# Altium schematic sheet Radio1.SchDoc
size A4
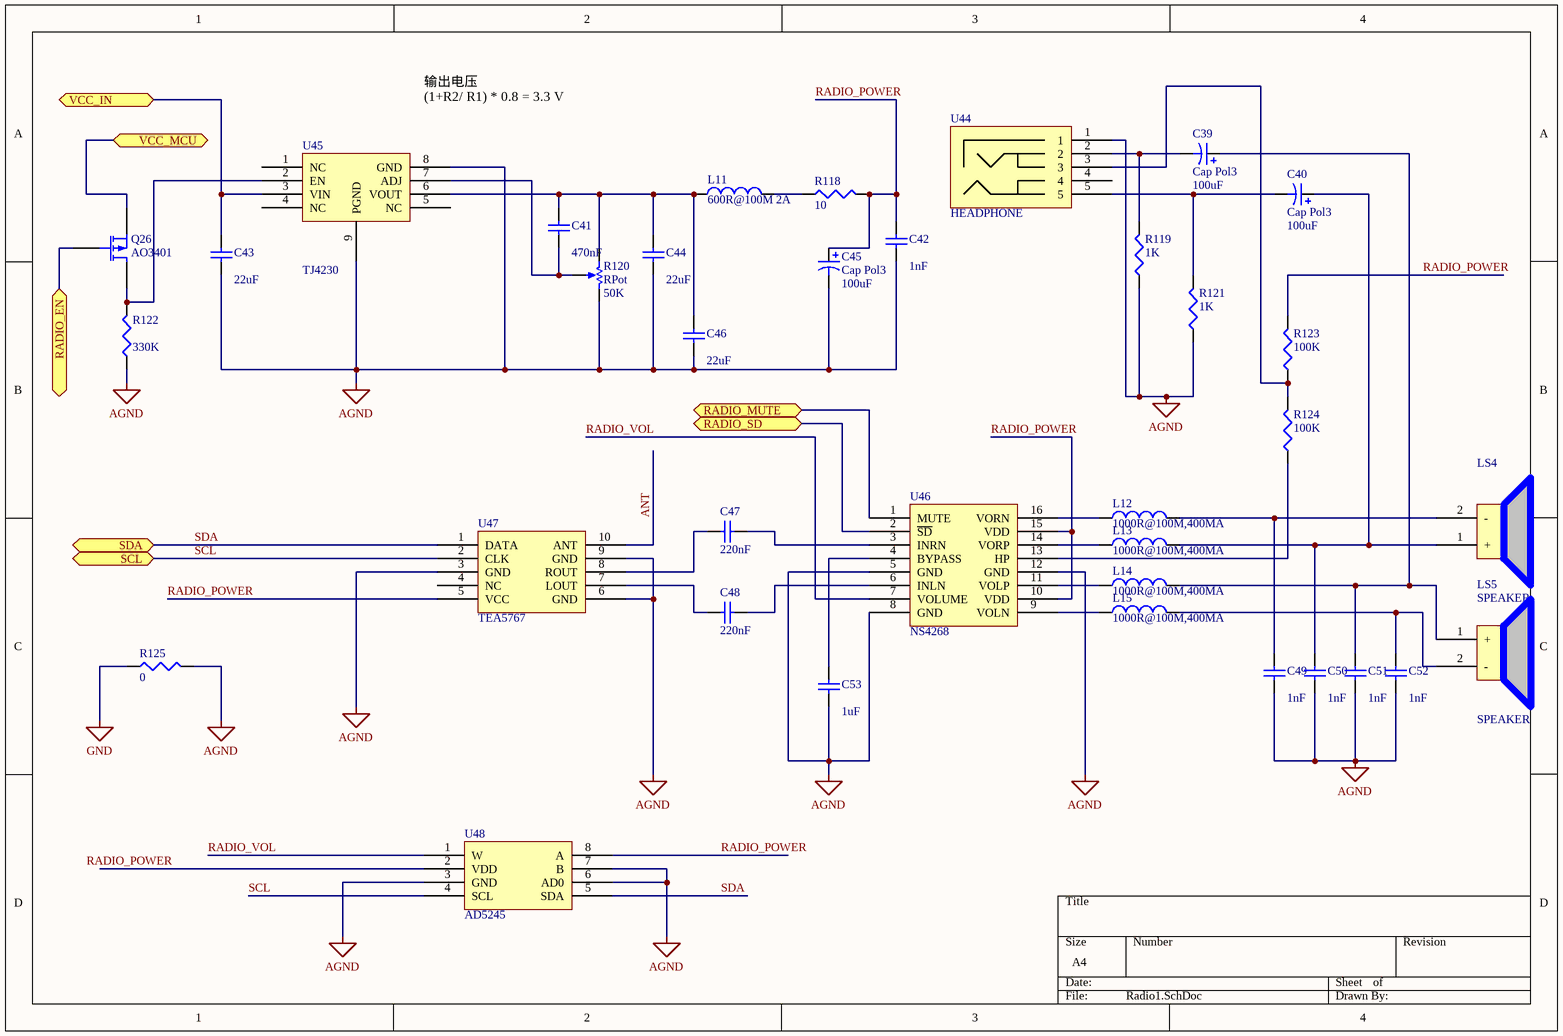
[diagram p0: Radio1.SchDoc]

## Parts
C39  Cap Pol3  value 100uF  [TC7343-2917]
C40  Cap Pol3  value 100uF  [TC7343-2917]
C41  value 470nF  [0603]  (hidden comment: Cap Semi)
C42  value 1nF  [0603]  (hidden comment: Cap Semi)
C43  value 22uF  [1206]  (hidden comment: Cap Semi)
C44  value 22uF  [1206]  (hidden comment: Cap Semi)
C45  Cap Pol3  value 100uF  [TC7343-2917]
C46  value 22uF  [1210]  (hidden comment: Cap Semi)
C47  value 220nF  [0603]  (hidden comment: Cap Semi)
C48  value 220nF  [0603]  (hidden comment: Cap Semi)
C49  value 1nF  [0603]  (hidden comment: Cap Semi)
C50  value 1nF  [0603]  (hidden comment: Cap Semi)
C51  value 1nF  [0603]  (hidden comment: Cap Semi)
C52  value 1nF  [0603]  (hidden comment: Cap Semi)
C53  value 1uF  [0603]  (hidden comment: Cap Semi)
L11  value 600R@100M 2A  [AXIAL-0.6]  (hidden comment: Inductor)
L12  value 1000R@100M,400MA  [0805]  (hidden comment: Inductor)
L13  value 1000R@100M,400MA  [0805]  (hidden comment: Inductor)
L14  value 1000R@100M,400MA  [0805]  (hidden comment: Inductor)
L15  value 1000R@100M,400MA  [0805]  (hidden comment: Inductor)
LS4  SPEAKER  [SPEAKER]
LS5  SPEAKER  [SPEAKER]
Q26  AO3401  [SOT23-3-PMOS]
R118  value 10  [0603]  (hidden comment: Res3)
R119  value 1K  [0603]  (hidden comment: Res3)
R120  RPot  value 50K  [VR5]
R121  value 1K  [0603]  (hidden comment: Res3)
R122  value 330K  [0603]  (hidden comment: Res3)
R123  value 100K  [0603]  (hidden comment: Res3)
R124  value 100K  [0603]  (hidden comment: Res3)
R125  value 0  [0603]  (hidden comment: Res3)
U44  HEADPHONE  [HEADPHONE]
U45  TJ4230  [SOP8-PAD]
U46  NS4268  [SOP16]
U47  TEA5767  [TEA5767]
U48  AD5245  [SOT23-8]

## Ports
RADIO_EN (bidir), RADIO_MUTE (bidir), RADIO_SD (bidir), SCL (bidir), SDA (bidir), VCC_IN (bidir), VCC_MCU (bidir)

## Nets
AGND: C42.1 C43.1 C44.1 C45.2 C46.1 C49.1 C50.1 C51.1 C52.1 C53.1 R119.1 R120.1(TOP) R121.1 R122.1 R125.2 U44.1 U45.8(GND) U45.9(PGND) U46.5(GND) U46.8(GND) U46.12(GND) U47.3(GND) U47.6(GND) U47.9(GND) U48.3(GND) U48.6(AD0) U48.7(B)
GND: R125.1
ANT: U47.10(ANT)
RADIO_EN: Q26.2(G) ; port RADIO_EN
RADIO_MUTE: U46.1(MUTE) ; port RADIO_MUTE
RADIO_POWER: C42.2 C45.1 R118.2 R123.2 U46.10(VDD) U46.15(VDD) U47.5(VCC) U48.8(A)
RADIO_SD: U46.2(~{SD}) ; port RADIO_SD
RADIO_VOL: U46.7(VOLUME) U48.1(W)
SCL: U47.2(CLK) U48.4(SCL) ; port SCL
SDA: U47.1(DATA) U48.5(SDA) ; port SDA
VCC_IN: C43.2 U45.3(VIN) ; port VCC_IN
VCC_MCU: Q26.3(S) ; port VCC_MCU
NetC39_1: C39.1 C51.2 L14.2 LS5.1(+)
NetC39_2: C39.2 R119.2 U44.2
NetC40_1: C40.1 C50.2 L13.2 LS4.1(+)
NetC40_2: C40.2 R121.2 U44.5
NetC41_1: C41.1 R120.3(TAP) U45.7(ADJ)
NetC41_2: C41.2 C44.2 C46.2 L11.1 R120.2(BOT) U45.6(VOUT)
NetC47_1: C47.1 U46.3(INRN)
NetC47_2: C47.2 U47.8(ROUT)
NetC48_1: C48.1 U46.6(INLN)
NetC48_2: C48.2 U47.7(LOUT)
NetC49_2: C49.2 L12.2 LS4.2(-)
NetC52_2: C52.2 L15.2 LS5.2(-)
NetC53_2: C53.2 U46.4(BYPASS)
NetL11_2: L11.2 R118.1
NetL12_1: L12.1 U46.16(VORN)
NetL13_1: L13.1 U46.14(VORP)
NetL14_1: L14.1 U46.11(VOLP)
NetL15_1: L15.1 U46.9(VOLN)
NetQ26_1: Q26.1(D) R122.2 U45.2(EN)
NetR123_1: R123.1 R124.2 U44.3
NetR124_1: R124.1 U46.13(HP)

Not connected (* = marked no-connect by the designer): U44 4; U45 1(NC) 4(NC) 5(NC); U47 4(NC); U48 2(VDD)

## Notes on the sheet
- 输出电压
  (1+R2/ R1) * 0.8 = 3.3 V
- Labels drawn without touching a wire or pin: RADIO_POWER

## Library data of the parts
C39 C40 C45 = Cap Pol3: Polarized Capacitor (Surface Mount); Published: 8-Jun-2000; LatestRevisionDate: 29-May-2009; LatestRevisionNote: IPC-7351 Footprint Added.; PackageReference: C0805; Publisher: Altium Limited; PackageDescription: Chip Capacitor
C41-C44 C46-C53 = Cap Semi: Capacitor (Semiconductor SIM Model); Published: 8-Jun-2000; LatestRevisionDate: 29-May-2009; LatestRevisionNote: IPC-7351 Footprint Added.; PackageReference: C1206; Publisher: Altium Limited; PackageDescription: Chip Capacitor
L11-L15 = Inductor: Code_IEC: 1005; Published: 8-Jun-2000; LatestRevisionDate: 29-May-2009; LatestRevisionNote: IPC-7351 Footprint Added.; PackageReference: 0402-A; Publisher: Altium Limited; PackageDescription: Chip Inductor; Code_JEITA: 0402
Q26 = MOSFET-P: P-Channel MOSFET; Published: 8-Jun-2000; LatestRevisionDate: 17-Jul-2002; LatestRevisionNote: Re-released for DXP Platform.; PackageVersion: 1995/1996; PackageReference: E3; Publisher: Altium Limited; PackageDescription: TO, Flat Index; 3 In-Line, Axial Leads; Body Dia. 4.6mm; Lead Dia. 0.5 mm (max)
R118 R119 R121-R125 = Res3: Resistor; Published: 8-Jun-2000; LatestRevisionDate: 29-May-2009; LatestRevisionNote: IPC-7351 Footprint Added.; PackageReference: J1-0603; Publisher: Altium Limited; PackageDescription: Chip Resistor
R120 = RPot: Potentiometer; Sim Note: Enter the Resistance value and the set point into parameter fields.; Set Position: 0.5; Published: 8-Jun-2000; LatestRevisionDate: 17-Jul-2002; LatestRevisionNote: Re-released for DXP Platform.; PackageReference: VR5; Publisher: Altium Limited; PackageDescription: Variable Resistor, Thru-Hole; 3 Leads